# EAGLE design LIC_V-00237-00 (EAGLE 7.2.0)
AUTHOR: M. Petrilak; VERSION: 00
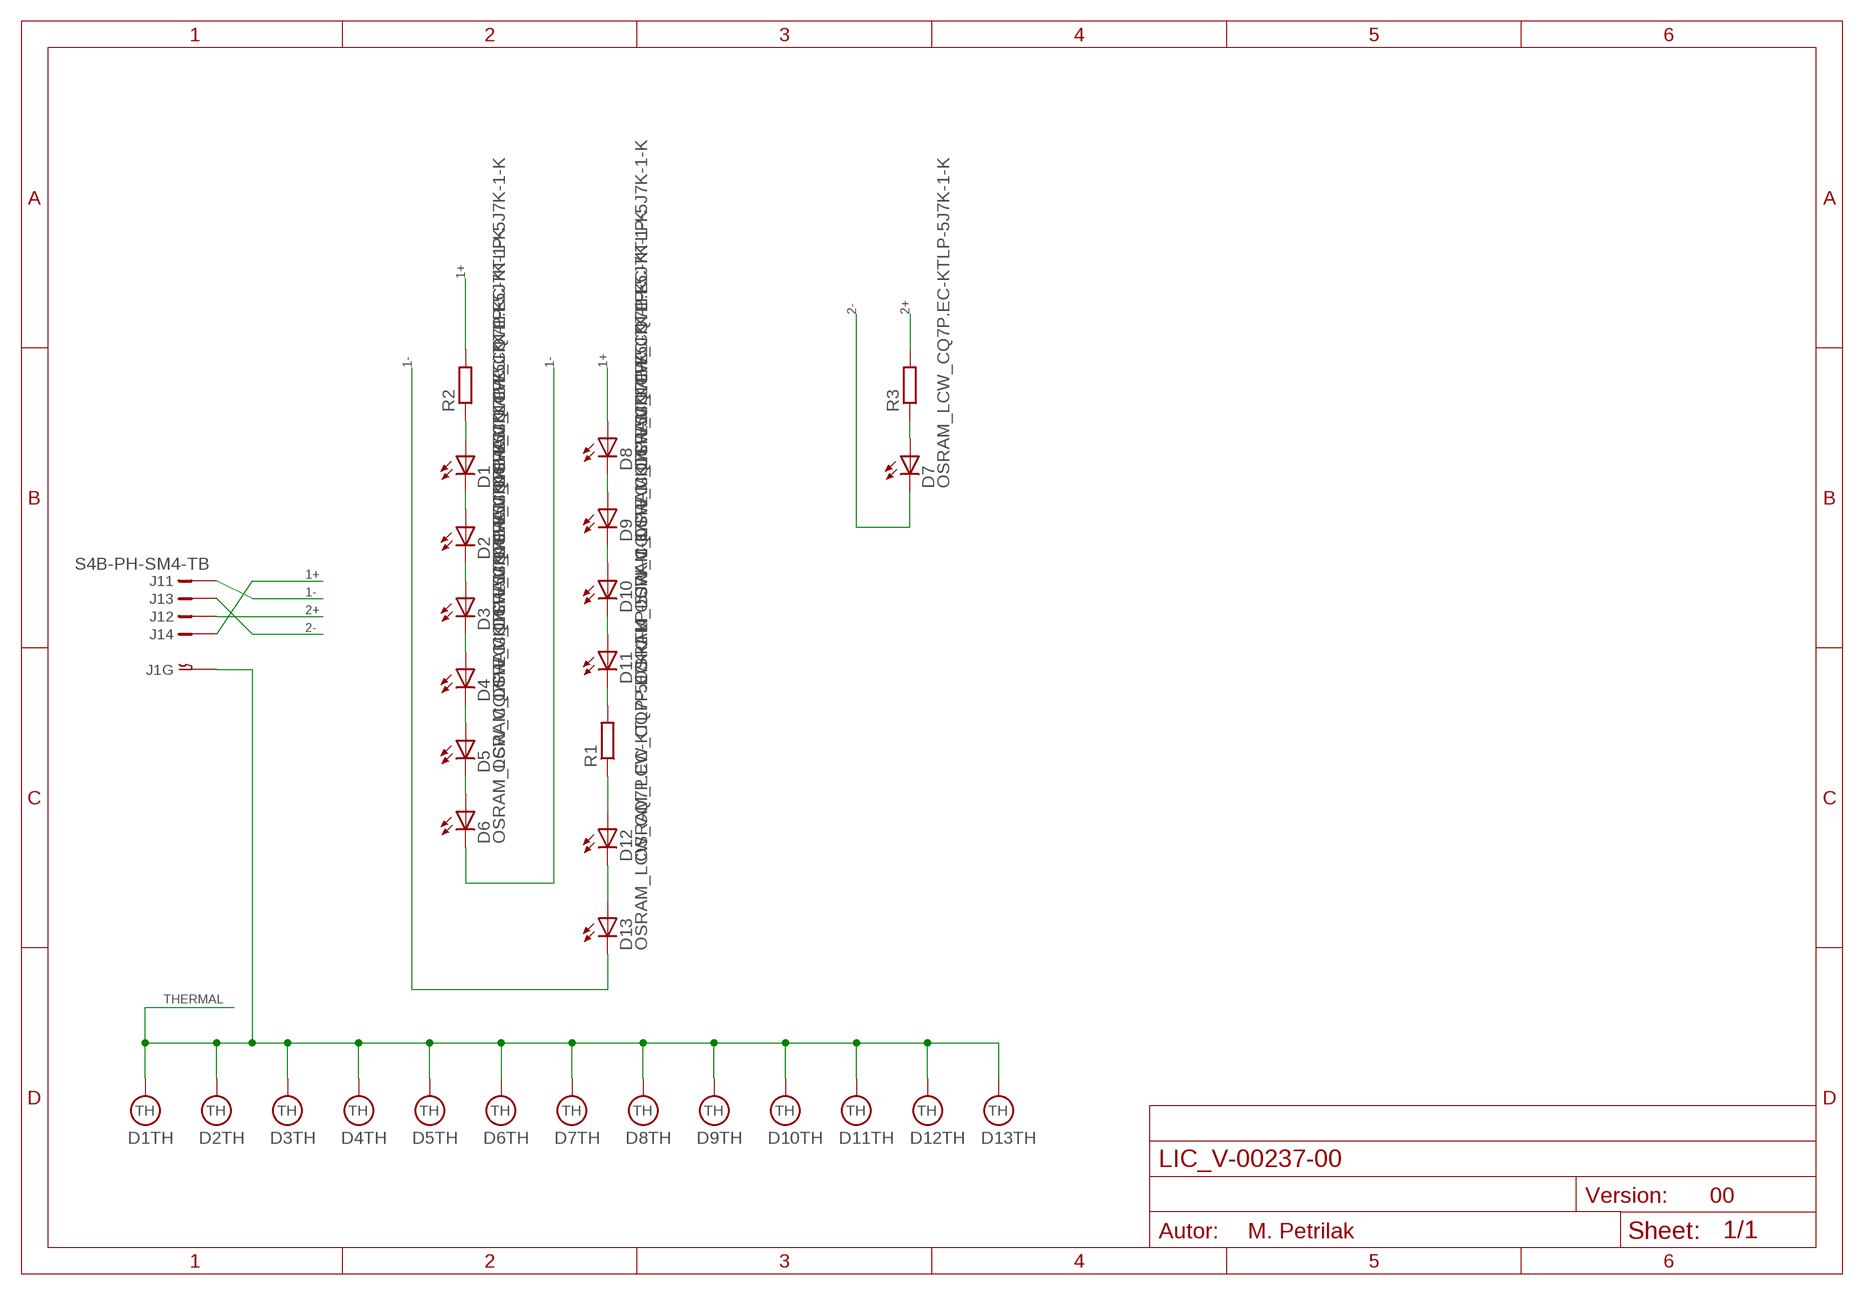
[diagram p0: schematic, sheet 1]

## Parts
D1  OSRAM_LCW_CQ7P.EC-KTLP-5J7K-1-K  [OSRAM_LCW]
D2  OSRAM_LCW_CQ7P.EC-KTLP-5J7K-1-K  [OSRAM_LCW]
D3  OSRAM_LCW_CQ7P.EC-KTLP-5J7K-1-K  [OSRAM_LCW]
D4  OSRAM_LCW_CQ7P.EC-KTLP-5J7K-1-K  [OSRAM_LCW]
D5  OSRAM_LCW_CQ7P.EC-KTLP-5J7K-1-K  [OSRAM_LCW]
D6  OSRAM_LCW_CQ7P.EC-KTLP-5J7K-1-K  [OSRAM_LCW]
D7  OSRAM_LCW_CQ7P.EC-KTLP-5J7K-1-K  [OSRAM_LCW]
D8  OSRAM_LCW_CQ7P.EC-KTLP-5J7K-1-K  [OSRAM_LCW]
D9  OSRAM_LCW_CQ7P.EC-KTLP-5J7K-1-K  [OSRAM_LCW]
D10  OSRAM_LCW_CQ7P.EC-KTLP-5J7K-1-K  [OSRAM_LCW]
D11  OSRAM_LCW_CQ7P.EC-KTLP-5J7K-1-K  [OSRAM_LCW]
D12  OSRAM_LCW_CQ7P.EC-KTLP-5J7K-1-K  [OSRAM_LCW]
D13  OSRAM_LCW_CQ7P.EC-KTLP-5J7K-1-K  [OSRAM_LCW]
J1  S4B-PH-SM4-TB  [S4B-PH-SM4-TB]
R1  R-EU_R1206  [R1206]
R2  R-EU_R1206  [R1206]
R3  R-EU_R1206  [R1206]

## Nets
1+: D8.A J1.4 R2.2
1-: D6.C D13.C J1.1
2+: J1.2 R3.2
2-: D7.C J1.3
N$1: D1.C D2.A
N$2: D2.C D3.A
N$3: D3.C D4.A
N$4: D4.C D5.A
N$5: D5.C D6.A
N$6: D1.A R2.1
N$7: D8.C D9.A
N$8: D9.C D10.A
N$9: D10.C D11.A
N$10: D12.A R1.1
N$11: D11.C R1.2
N$12: D7.A R3.1
N$14: D12.C D13.A
THERMAL: D1.THERMAL(TH) D2.THERMAL(TH) D3.THERMAL(TH) D4.THERMAL(TH) D5.THERMAL(TH) D6.THERMAL(TH) D7.THERMAL(TH) D8.THERMAL(TH) D9.THERMAL(TH) D10.THERMAL(TH) D11.THERMAL(TH) D12.THERMAL(TH) D13.THERMAL(TH) J1.GND1 J1.GND2

## Library data of the parts
D1-D13 = led:OSRAM_LCW_CQ7P.
J1 = con-jst:?4B-PH-SM4-TB: JST PH S4B-PH-SM4-TB pitch 2mm SMD side entry
R1-R3 = rcl:R-EU_: RESISTOR, European symbol

## Board
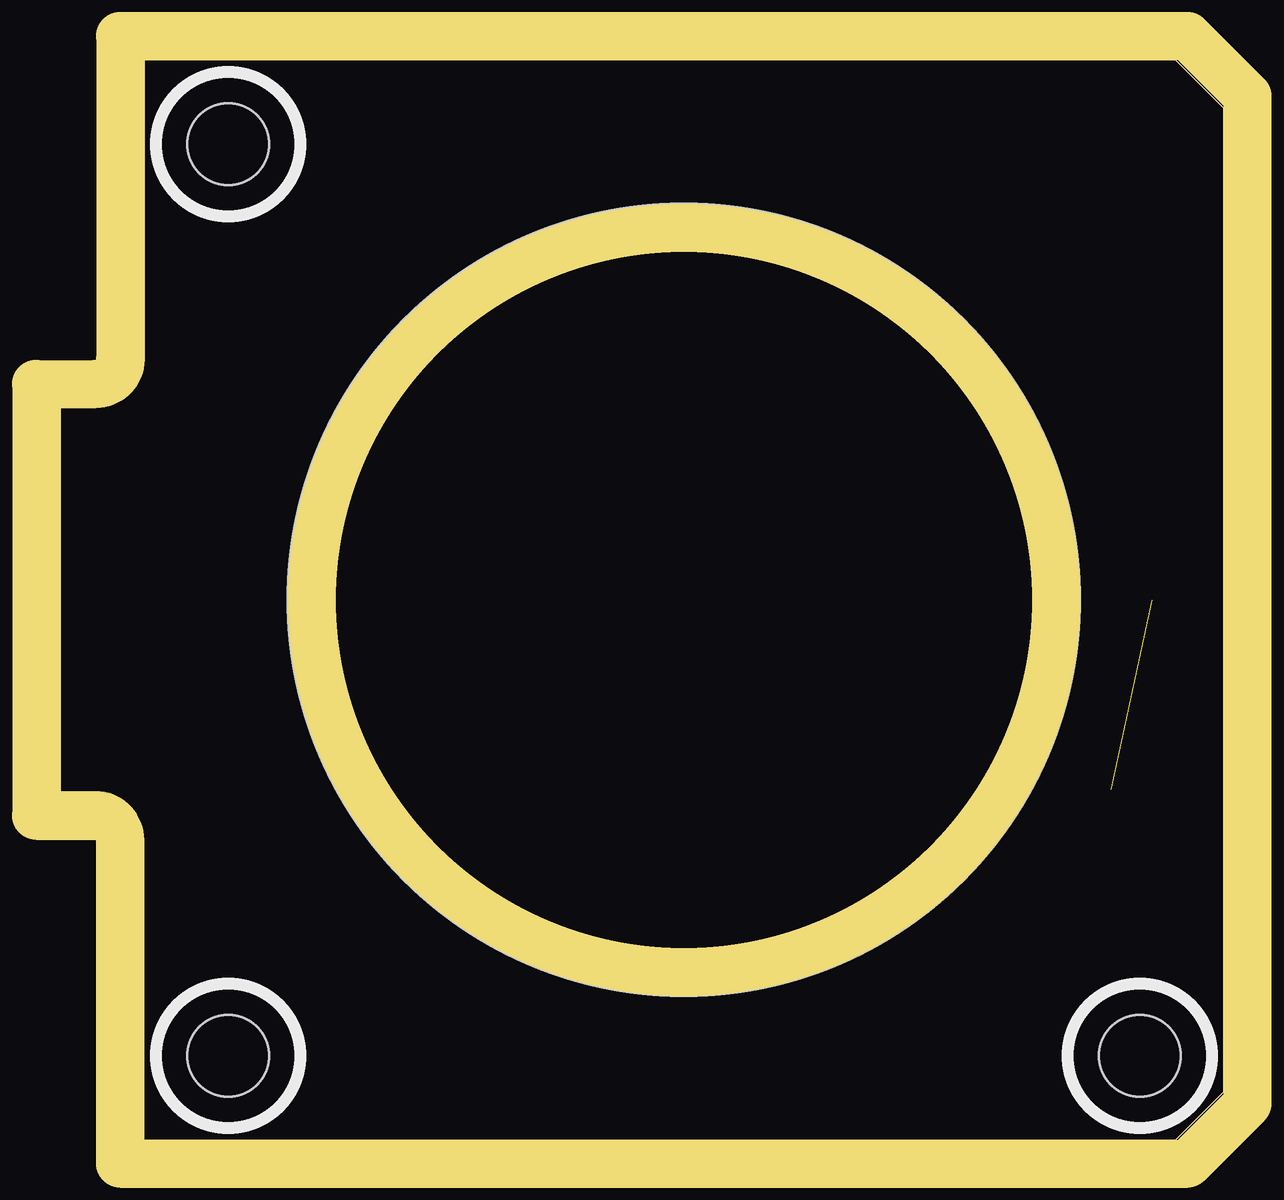
[diagram p1: board, top side]
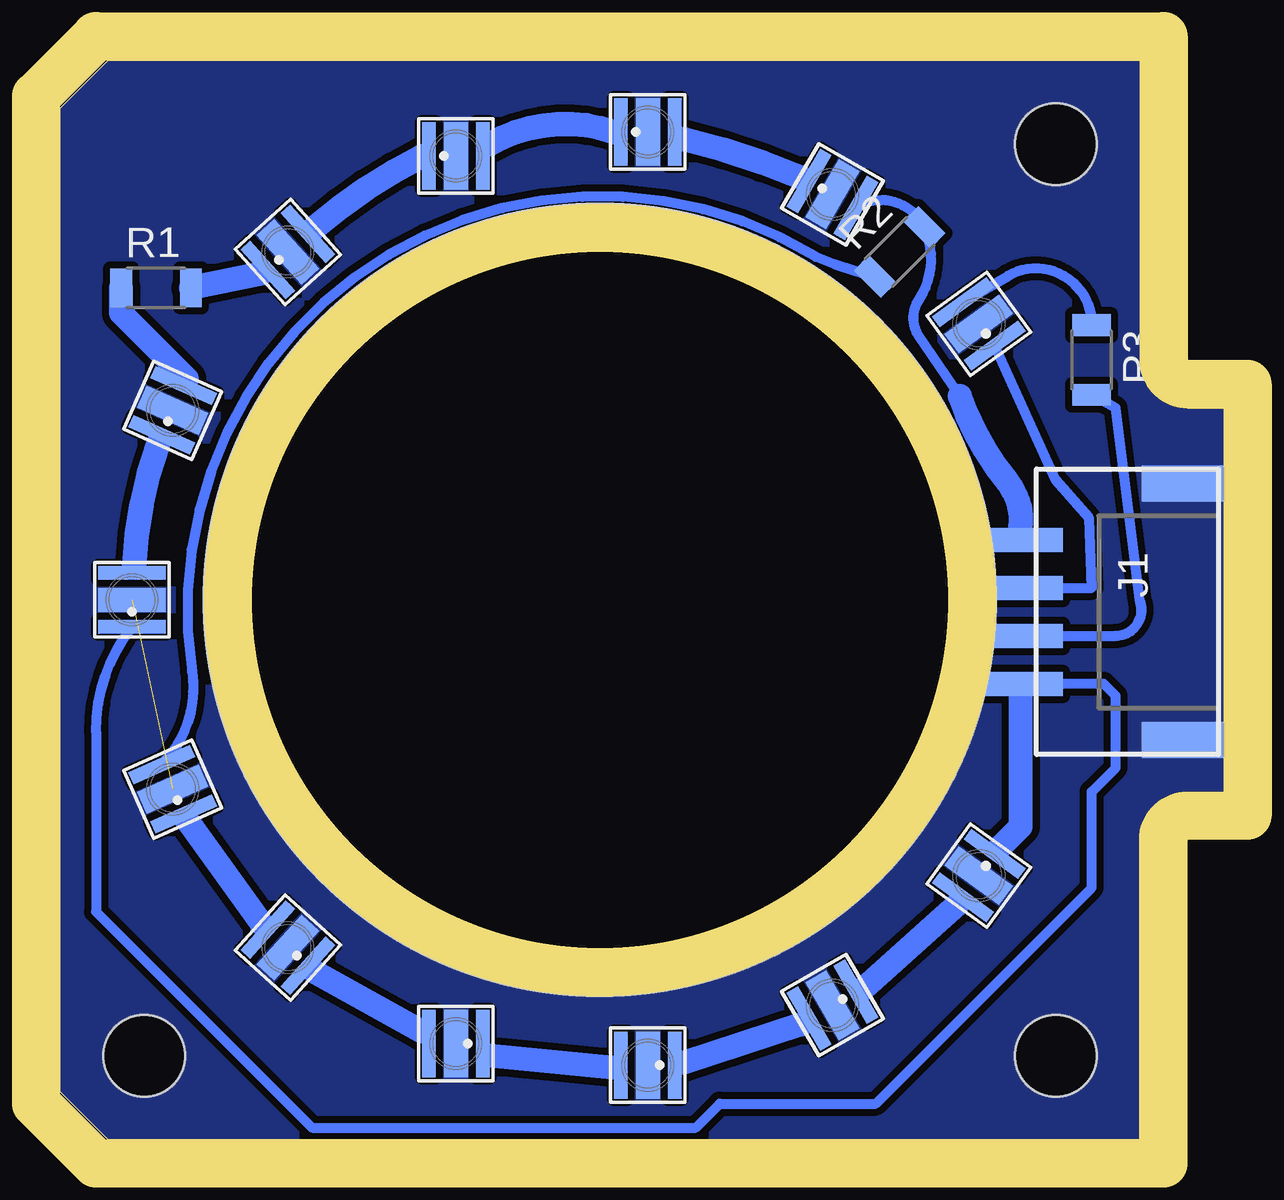
[diagram p2: board, bottom side, seen from below]

Size 48.5 x 45 mm. Coordinates in mm from the lower left corner, seen from the top.
Outline: 3.5,0 46.5,0 48.5,2 48.5,43 46.5,45 3.5,45 3.5,32.5 arc-90 1.5,30.5 0,30.5 0,14.5 1.5,14.5 arc-90 3.5,12.5 3.5,0
Copper layers (1*16): Top 0.04mm / dielectric 1.5mm / Bottom 0.04mm
Design rules "Michal_small *": minimum track width 0.2mm, minimum drill 0.3mm, track to track 0.3mm, track to pad 0.3mm, pad to pad 0.2mm, via to via 0.2mm, smd to smd 0mil, copper to edge 0.001mm, drill to drill 0.2mm, minimum pad ring 0.3mm, minimum via ring 0.3mm, stop-mask expansion 4mil, vias tented up to drill 0.5mm, thermal gap 0.2mm
Holes 3.4 mm at 45,3.5 7,41.5 7,3.5
Holes 33 mm at 26,22.5
Milling: area 10.5,7 to 41.5,38; 12 lines

### Footprints (pad centres in the part's own frame; a part is rotated, then mirrored left to right if it is on the bottom)
OSRAM_LCW = smd 0.55 x 2.8: A -1.125,0; C 1.125,0 | smd 1 x 2.8: THERMAL 0,0
S4B-PH-SM4-TB = smd 1 x 3.5: 1 3,-8.25; 2 1,-8.25; 3 -1,-8.25; 4 -3,-8.25 | smd 1.5 x 3.4: GND1 -5.35,-1.5; GND2 5.35,-1.5
R1206 = smd 0.9 x 1.6: 1 -1.45,0; 2 1.45,0

### Placement (x,y rotation side)
D1  43.8,14.6 294 bottom
D2  39,8 318 bottom
D3  32,4 0 bottom
D4  24,3.1 0 bottom
D5  16.3,5.6 30 bottom
D6  10.2,11 54 bottom
D7  10.2,34 306 bottom
D8  16.3,39.4 150 bottom
D9  24,42 180 bottom
D10  32,41 180 bottom
D11  39,37 222 bottom
D12  43.8,30.4 246 bottom
D13  45.5,22.5 270 bottom
J1  0.2,22 270 bottom
R1  44.5,35.5 0 bottom
R2  13.5,37 45 bottom
R3  5.5,32.5 270 bottom

### Tracks (layer width: path | path; a pad name or v marks a point on that pad's centre or on a via)
1+
  Bottom 0.406: 11,31 12.7,33.5 arc67 12.7,35 arc-59 R2.2 arc-98 D8.A
  Bottom 1.016: J1.4 8.5,25.3 arc-51 9,27.4 arc20 11,31
1-
  Bottom 0.406: J1.1 5,19 4.5,18.5 4.5,15.5 5.5,14.5 5.5,10.5 14.5,1.5 21,1.5 22,0.5 38,0.5 47,9.5 47,17 arc38 D13.C | 9.3,12.2 arc-11 D6.C
  Bottom 1: 9.3,12.2 8.45,13.05 J1.1
2+
  Bottom 0.406: J1.2 4.5,21 arc-113 3.5,22.5 4.5,30.5 R3.2
2-
  Bottom 0.406: J1.3 5.5,23 5.6,25.9 7,27.5 D7.C
N$1
  Bottom 0.406: D1.C 43.2,13.3 | D2.A 40.1,9
  Bottom 1: 40.1,9 43.2,13.3
N$2
  Bottom 0.406: D2.C 37.9,7 | D3.A 33.4,4.5
  Bottom 1: 33.4,4.5 37.9,7
N$3
  Bottom 0.406: D3.C 30.6,3.5 | D4.A 25.5,3
  Bottom 1: 25.5,3 30.6,3.5
N$4
  Bottom 0.406: D4.C 22.5,3.2 | D5.A 17.6,4.8
  Bottom 1: 17.6,4.8 22.5,3.2
N$5
  Bottom 0.406: D5.C 15,6.3 | D6.A 11.1,9.8
  Bottom 1: 11.1,9.8 15,6.3
N$6
  Bottom 0.406: D1.A arc-53 43,19.5 arc130 17,36.8 arc-8 R2.1
N$7
  Bottom 0.406: D8.C 17.6,40.1 | D9.A 22.5,41.7
  Bottom 1.016: 17.6,40.1 arc-9 22.5,41.7
N$8
  Bottom 0.406: D9.C 25.4,42 | D10.A 30.6,41.5
  Bottom 1.016: 25.4,42 arc-48 30.6,41.5
N$9
  Bottom 0.406: D10.C 33.4,41 | D11.A 37.9,38
  Bottom 1.016: 37.9,38 arc14 33.4,41
N$10
  Bottom 0.406: D12.A 43.2,31.7
  Bottom 1: 43.2,31.7 45.95,34.45 R1.1
N$11
  Bottom 0.406: D11.C 40.1,36.1
  Bottom 1: 40.1,36.1 R1.2
N$12
  Bottom 0.406: D7.A 9,36 arc121 R3.1
N$14
  Bottom 0.406: D13.A 45.4,23.9 | D12.C 44.4,29
  Bottom 1.016: 44.4,29 arc-17 45.4,23.9
THERMAL  (1 unrouted)
  pour Bottom (rank 3, no thermals): 0,0 49.5,0 49.5,45.5 0,45.5